# Altium schematic sheet K210Module.SchDoc
size A4; SheetNumber: 1; SheetTotal: 3
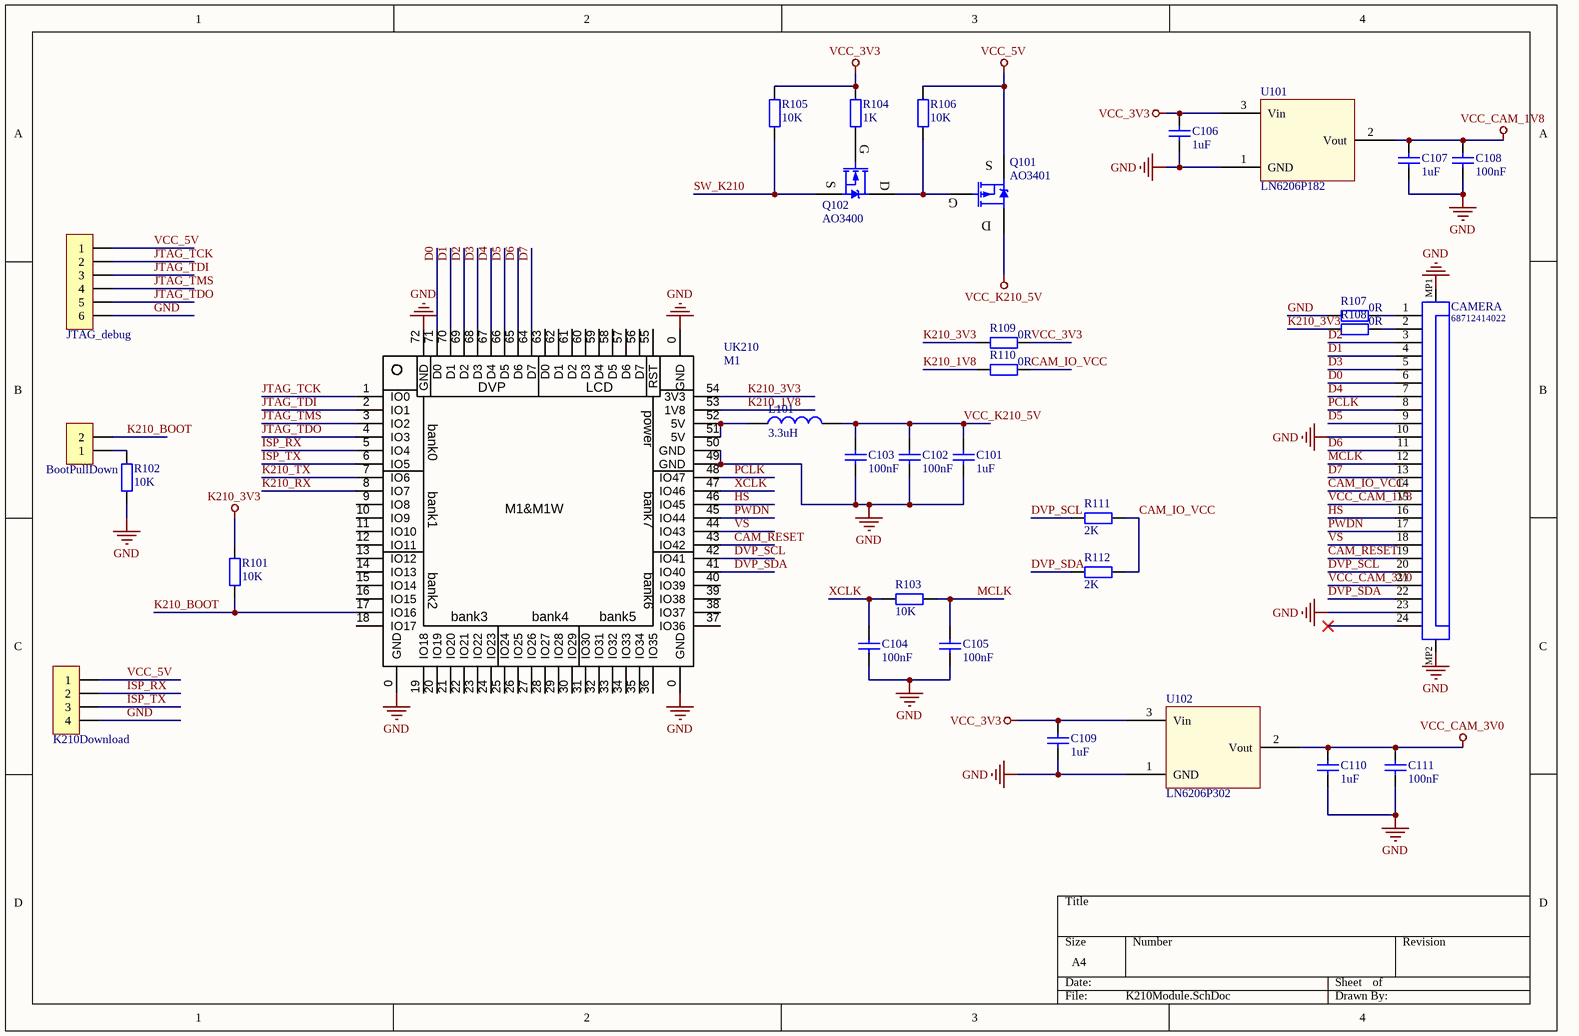
[diagram p0: K210Module.SchDoc]

## Parts
BootPullDown  HDR-1X2  [HDR2.54-LI-2P]  (value not drawn)
C101  1uF  [C0603_L]
C102  100nF  [C0603_L]
C103  100nF  [C0603_L]
C104  100nF  [C0603_L]
C105  100nF  [C0603_L]
C106  1uF  [C0603_L]
C107  1uF  [C0603_L]
C108  100nF  [C0603_L]
C109  1uF  [C0603_L]
C110  1uF  [C0603_L]
C111  100nF  [C0603_L]
CAMERA  68712414022  [68712414022]
JTAG_debug  HDR-1X6  [XH2.54-LI-6P]  (value not drawn)
K210Download  HDR-1X4  [XH2.54-LI-4P]  (value not drawn)
L101  3.3uH  [L0805]
Q101  AO3401  [SOT23-3N]
Q102  AO3400  [SOT23-3N]
R101  10K  [R0603_L]
R102  10K  [R0603_L]
R103  10K  [R0603_L]
R104  1K  [R0603_L]
R105  10K  [R0603_L]
R106  10K  [R0603_L]
R107  0R  [R0603_L]
R108  0R  [R0603_L]
R109  0R  [R0603_L]
R110  0R  [R0603_L]
R111  2K  [R0603_L]
R112  2K  [R0603_L]
U101  LN6206P182  [SOT23-3L]
U102  LN6206P302  [SOT23-3L]
UK210  M1  [M1]

## Nets
GND: C101.1 C102.1 C103.1 C104.1 C105.1 C106.1 C107.1 C108.1 C109.1 C110.1 C111.1 CAMERA.10 CAMERA.23 CAMERA.MP1 CAMERA.MP2 JTAG_debug.6 K210Download.4 R102.2 R107.2 U101.1(GND) U102.1(GND) UK210.0(GND) UK210.49(GND) UK210.50(GND) UK210.72(GND)
K210_3V3: R101.2 R108.2 R109.2 UK210.54(3V3)
VCC_3V3: C106.2 C109.2 R104.2 R105.2 R109.1 U101.3(Vin) U102.3(Vin)
VCC_5V: JTAG_debug.1 K210Download.1 Q101.2(S) R106.2
VCC_CAM_1V8: C107.2 C108.2 CAMERA.15 U101.2(Vout)
VCC_CAM_3V0: C110.2 C111.2 CAMERA.21 U102.2(Vout)
VCC_K210_5V: C101.2 C102.2 C103.2 L101.2 Q101.3(D)
CAM_IO_VCC: CAMERA.14 R110.1 R111.2 R112.2
CAM_RESET: CAMERA.19 UK210.43(IO42)
D0: CAMERA.6 UK210.71(D0)
D1: CAMERA.4 UK210.70(D1)
D2: CAMERA.3 UK210.69(D2)
D3: CAMERA.5 UK210.68(D3)
D4: CAMERA.7 UK210.67(D4)
D5: CAMERA.9 UK210.66(D5)
D6: CAMERA.11 UK210.65(D6)
D7: CAMERA.13 UK210.64(D7)
DVP_SCL: CAMERA.20 R111.1 UK210.42(IO41)
DVP_SDA: CAMERA.22 R112.1 UK210.41(IO40)
HS: CAMERA.16 UK210.46(IO45)
ISP_RX: K210Download.2 UK210.5(IO4)
ISP_TX: K210Download.3 UK210.6(IO5)
JTAG_TCK: JTAG_debug.2 UK210.1(IO0)
JTAG_TDI: JTAG_debug.3 UK210.2(IO1)
JTAG_TDO: JTAG_debug.5 UK210.4(IO3)
JTAG_TMS: JTAG_debug.4 UK210.3(IO2)
K210_1V8: R110.2 UK210.53(1V8)
K210_BOOT: BootPullDown.2 R101.1 UK210.17(IO16)
K210_RX: UK210.8(IO7)
K210_TX: UK210.7(IO6)
MCLK: C105.2 CAMERA.12 R103.2
PCLK: CAMERA.8 UK210.48(IO47)
PWDN: CAMERA.17 UK210.45(IO44)
SW_K210: Q102.2(S) R105.1
VS: CAMERA.18 UK210.44(IO43)
XCLK: C104.2 R103.1 UK210.47(IO46)
NetBootPullDown_1: BootPullDown.1 R102.1
NetCAMERA_1: CAMERA.1 R107.1
NetCAMERA_2: CAMERA.2 R108.1
NetL101_1: L101.1 UK210.51(5V) UK210.52(5V)
NetQ101_1: Q101.1(G) Q102.3(D) R106.1
NetQ102_1: Q102.1(G) R104.1

Not connected (* = marked no-connect by the designer): CAMERA 24*; UK210 9(IO8) 10(IO9) 11(IO10) 12(IO11) 13(IO12) 14(IO13) 15(IO14) 16(IO15) 18(IO17) 19(IO18) 20(IO19) 21(IO20) 22(IO21) 23(IO22) 24(IO23) 25(IO24) 26(IO25) 27(IO26) 28(IO27) 29(IO28) 30(IO29) 31(IO30) 32(IO31) 33(IO32) 34(IO33) 35(IO34) 36(IO35) 37(IO36) 38(IO37) 39(IO38) 40(IO39) 55(RST) 56(D7) 57(D6) 58(D5) 59(D4) 60(D3) 61(D2) 62(D1) 63(D0)

## Notes on the sheet
- (in symbol M1) DVP; LCD; power; bank0; bank1; bank7; M1&M1W; bank2; bank6; bank3; bank4; bank5

## Library data of the parts
BootPullDown = Header 2: 2P接插件; 联系卖家，免费查找封装: 唯一出售店铺网址https://shop463601444.taobao.com; 封装库来自淘宝卖家ID：黄晶宝石: 其他店铺购入均为盗版封装库，请立即申请退款，本店现金奖励50~200元; BOM名称: 2P接插件
C101-C111 = C: 贴片电容/MLCC电容; BOM名称: 无极性贴片电容; 联系卖家，免费查找封装: 唯一出售店铺网址https://shop463601444.taobao.com
CAMERA = CMP-1502-01558-1: SMT ZIF Connectors WR-FPC, Horizontal, Top Contact, pitch 0.5 mm, 24 pins; Manufacturer: Wurth Elektronik; Rated Current: 0.5A; Pin Number: 24; Pitch: 0.5mm; Working Voltage: 50VAC; Contact Resistance: 20mOhm; Withstanding Voltage: 250VAC; Packaging: TapeandReel; Operating Temperature: -25to85degC; Manufacturer URL: http://www.we-online.de; Mounting Technology: SMT; Package Reference: 68712414022; Orientation: Horizontal; Datasheet URL: https://katalog.we-online.de/em/datasheet/68712414022.pdf; Contact Design: TopContact; Part Number: 68712414022; Publisher: WurthElektronik
JTAG_debug = Header 6: 6P接插件; 联系卖家，免费查找封装: 唯一出售店铺网址https://shop463601444.taobao.com; 封装库来自淘宝卖家ID：黄晶宝石: 其他店铺购入均为盗版封装库，请立即申请退款，本店现金奖励50~200元; BOM名称: 6P接插件
K210Download = Header 4: 4P接插件; 联系卖家，免费查找封装: 唯一出售店铺网址https://shop463601444.taobao.com; 封装库来自淘宝卖家ID：黄晶宝石: 其他店铺购入均为盗版封装库，请立即申请退款，本店现金奖励50~200元; BOM名称: 4P接插件
L101 = L: 贴片小功率电感; BOM名称: 小功率贴片电感; 联系卖家，免费查找封装: 唯一出售店铺网址https://shop463601444.taobao.com
Q101 = AO3401: P沟道 30V/4.2A; BOM名称: 场效应管; 8元以下特价购入的买家: 还可以联系卖家远程指导AD软件使用; 参数: P沟道 30V/4.2A
Q102 = AO3400: N沟道 30V/4.2A; BOM名称: 场效应管; 8元以下特价购入的买家: 还可以联系卖家远程指导AD软件使用; 参数: N沟道 30V/4.2A
R101-R112 = R: 贴片电阻; 联系卖家，免费查找封装: 唯一出售店铺网址https://shop463601444.taobao.com; BOM名称: 贴片电阻
U101 U102 = LN6206P*